# EasyEDA Pro project miniMQ.epro, board ArtNet-Pico
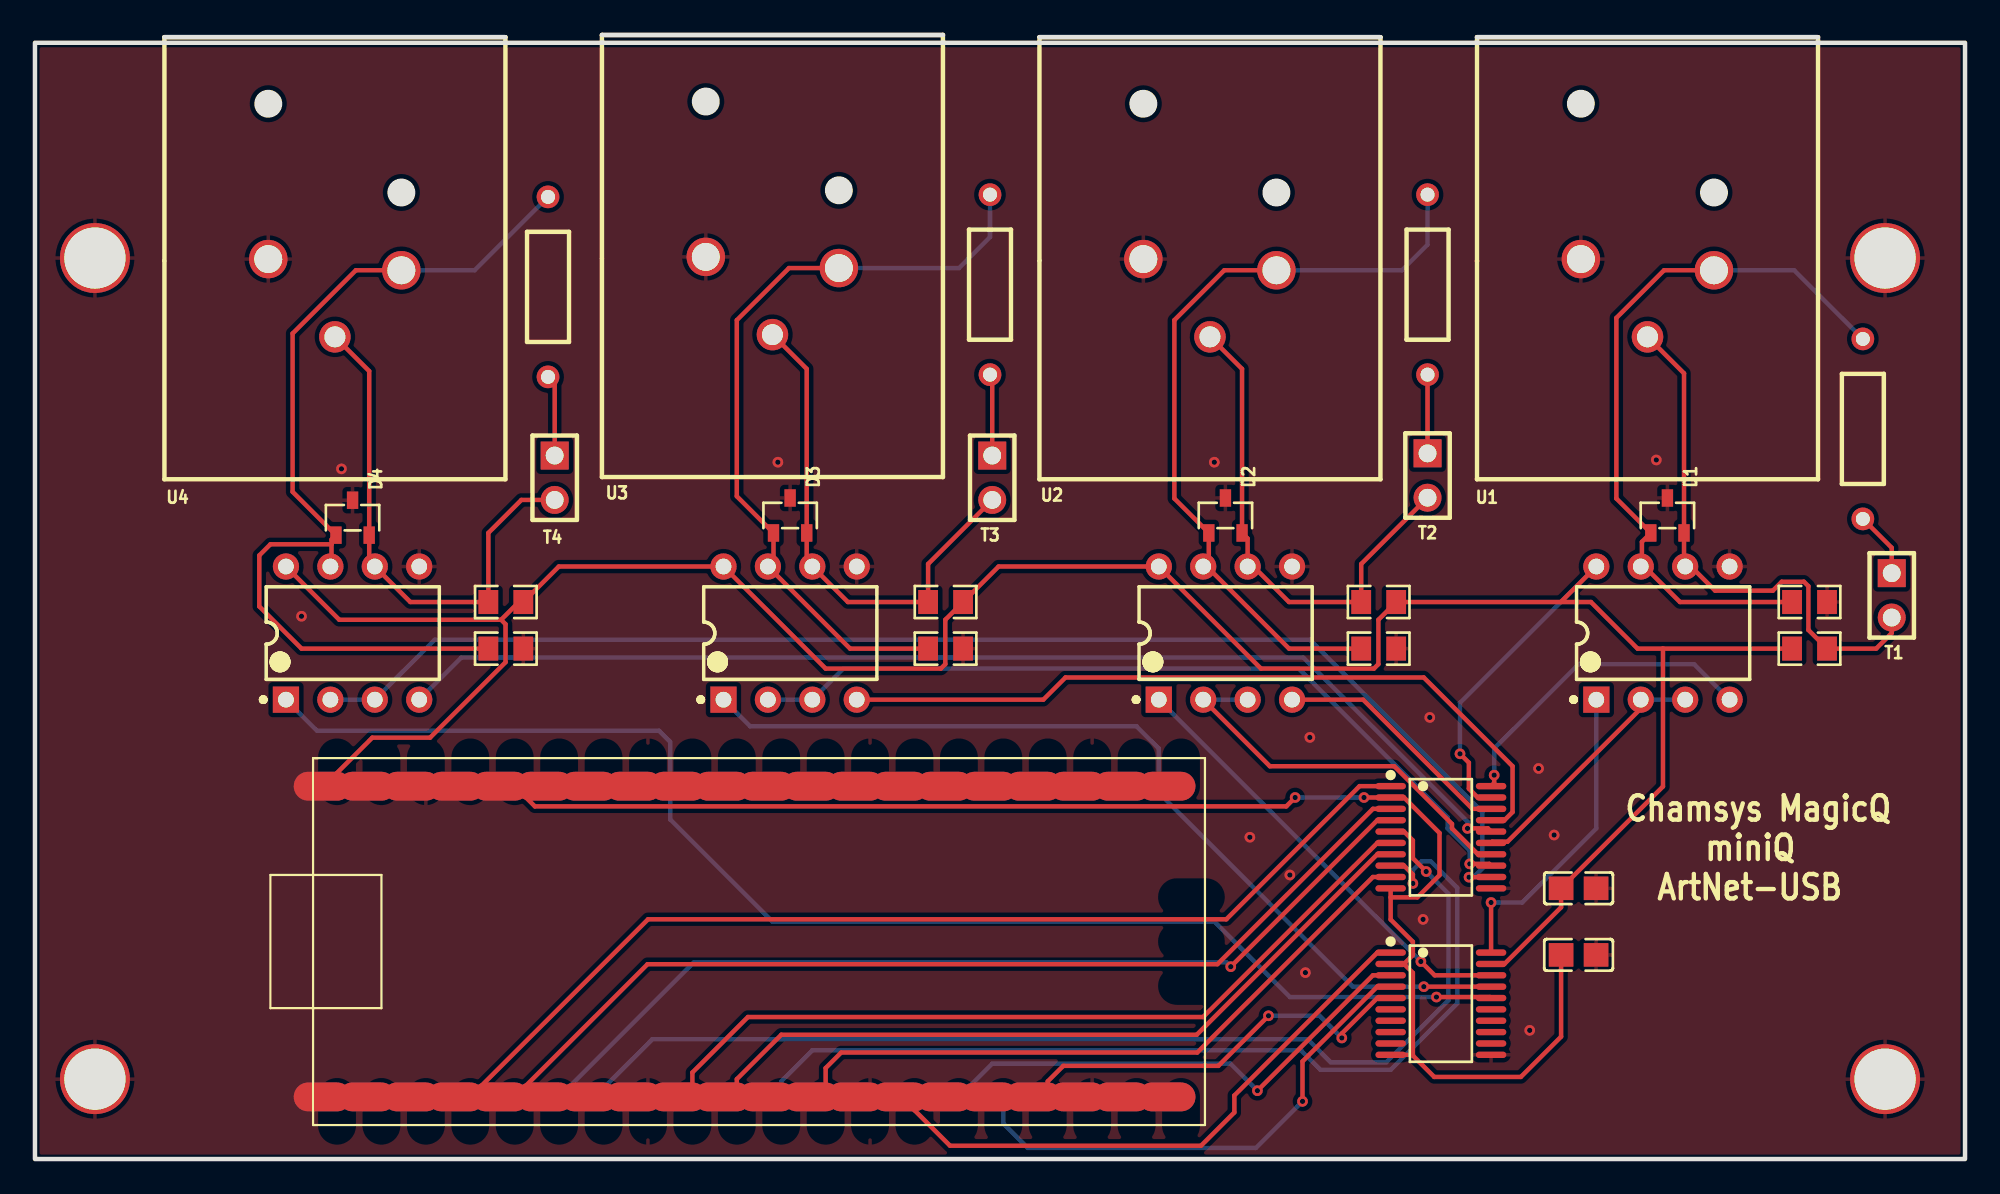
[diagram p13: board, top side]
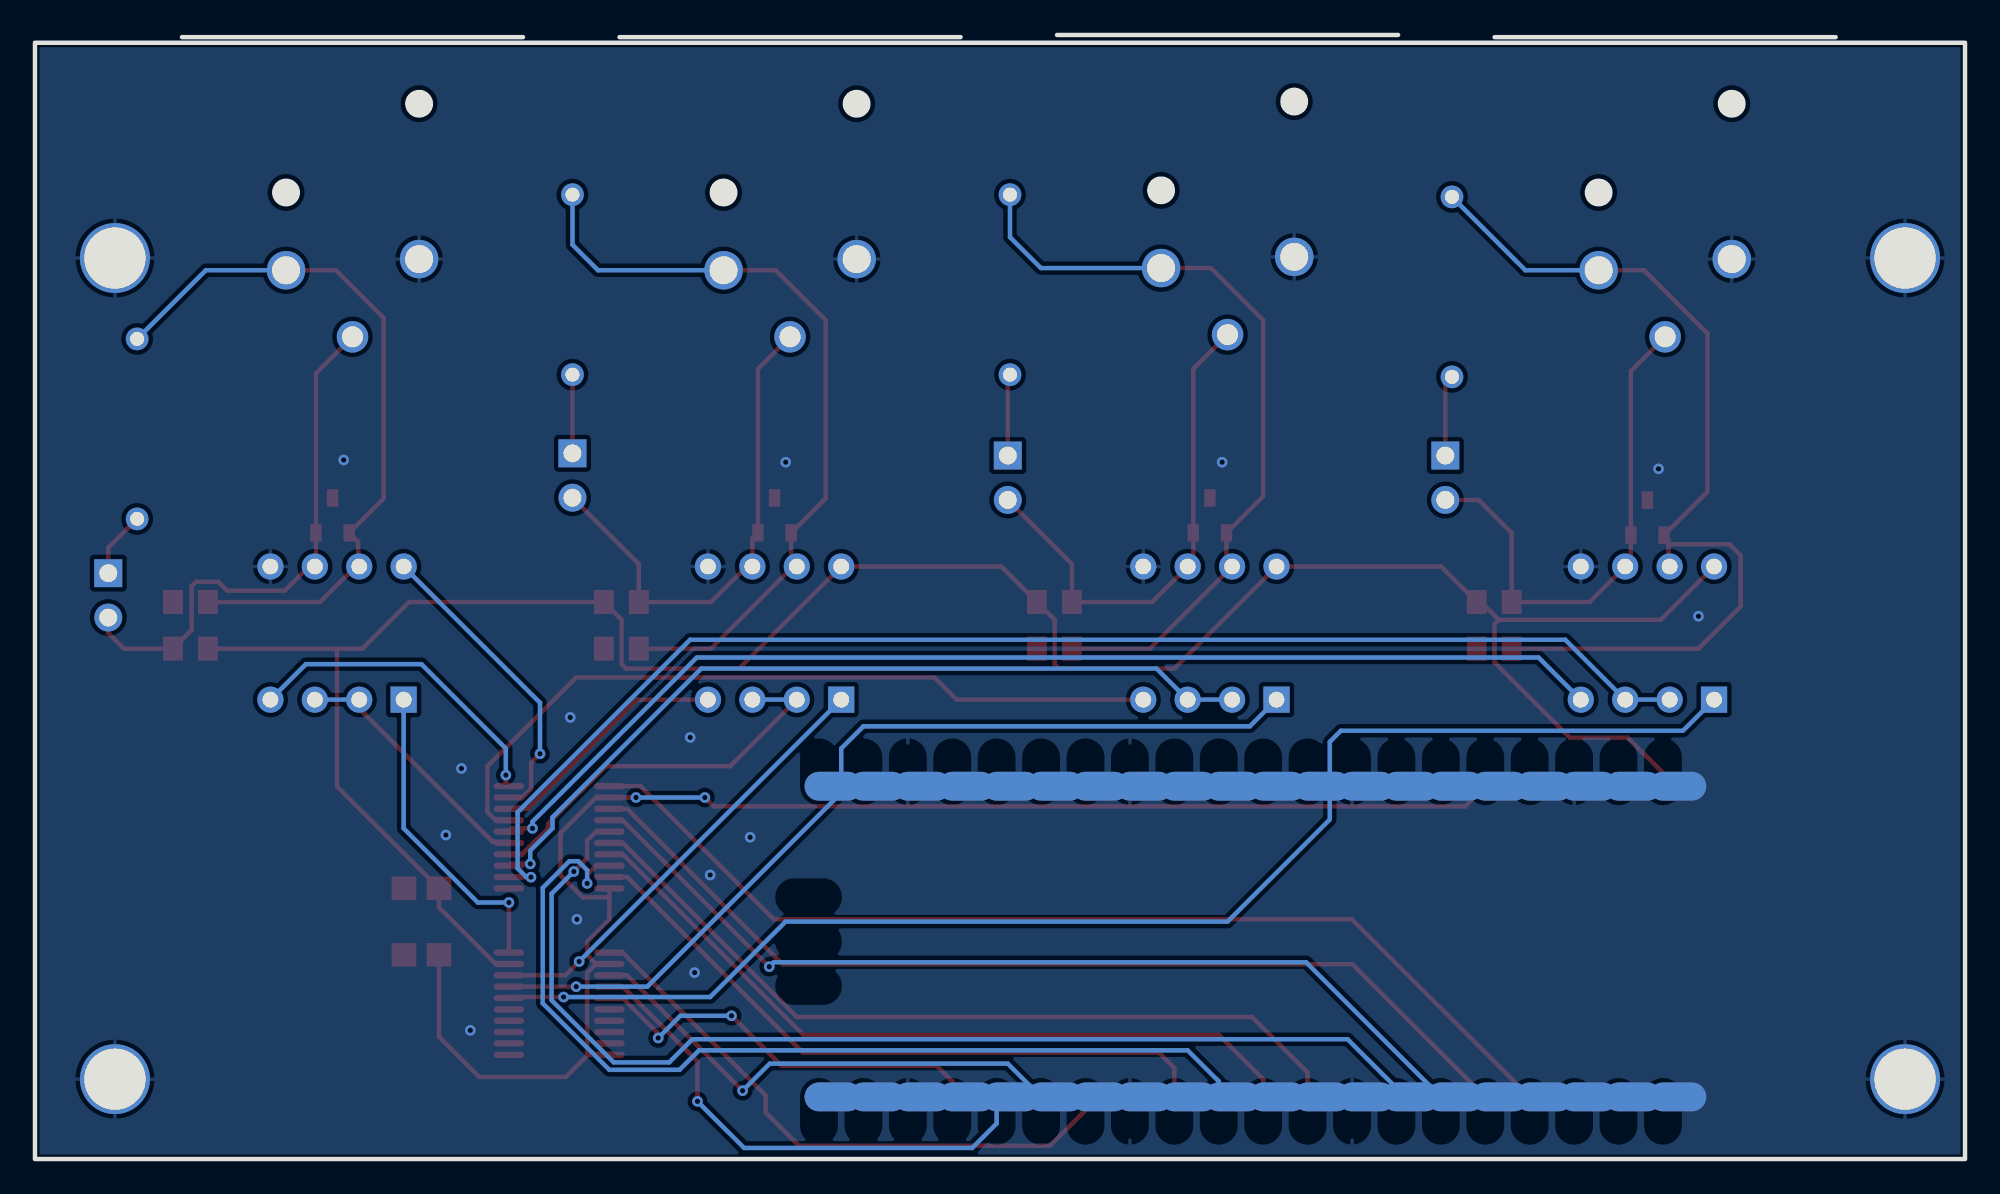
[diagram p14: board, bottom side, seen from below]

Outline 110.36 x 64.33 mm; copper layers: Top Layer, Bottom Layer. Coordinates in mm from the lower left corner of the outline.
Outline path: rectangle 0,63.88 110.36,0
Stack: Top Layer 0.035mm / Dielectric1 1.51mm FR4 er 4.5 / Bottom Layer 0.035mm

## Design rules (mm)
template: JLCPCB Capability(Two Layers Board)
spacing copperThickness1oz (default): track to track 0.102, other pairs 0.152 to 0.3
spacing copperThickness2oz: track to track 0.203, other pairs 0.152 to 0.3
track width copperThickness1oz (default): min 0.127, default 0.254, max 2.54
track width copperThickness2oz: min 0.203, default 0.254, max 2.54
differential pair differentialPair (default): width min 0.127, default 0.254, max 2.54; gap min 0.152, default 0.152
via viaSize (default): diameter min 0.5, default 0.61, max 10; hole min 0.3, default 0.305, max 6.3

## Placement (name value [footprint] x y rotation side)
C1  100nF  [C0805]  88.27 15.49 0 top
C2  100nF  [C0805]  88.27 11.68 180 top
D1  SM712-02HTG  [SOT-23-3_L2.9-W1.3-P1.90-LS2.4-BR]  93.34 36.83 270 top
D2  SM712-02HTG  [SOT-23-3_L2.9-W1.3-P1.90-LS2.4-BR]  68.07 36.83 270 top
D3  SM712-02HTG  [SOT-23-3_L2.9-W1.3-P1.90-LS2.4-BR]  43.18 36.83 270 top
D4  SM712-02HTG  [SOT-23-3_L2.9-W1.3-P1.90-LS2.4-BR]  18.16 36.7 270 top
NOREF  -  [Pad_e91]  105.79 51.56 0 top
NOREF#2  -  [Pad_e92]  105.79 4.57 0 top
NOREF#3  -  [Pad_e93]  3.43 4.57 0 top
NOREF#4  -  [Pad_e90]  3.43 51.56 0 top
R31  560Ω  [R0805]  101.47 31.88 0 top
R32  560Ω  [R0805]  101.47 29.21 180 top
R33  560Ω  [R0805]  76.83 29.21 0 top
R34  560Ω  [R0805]  76.83 31.88 0 top
R35  560Ω  [R0805]  52.07 29.21 0 top
R36  560Ω  [R0805]  52.07 31.88 0 top
R37  560Ω  [R0805]  26.92 29.21 0 top
R38  560Ω  [R0805]  26.92 31.88 0 top
T1  2.54x2.5 1x2P PA6.0 PC3.0 L11.6  [HDR-TH_2P-P2.54-V-M-R2-C1-S2.54_3]  106.17 32.26 180 top
T2  2.54x2.5 1x2P PA6.0 PC3.0 L11.6  [HDR-TH_2P-P2.54-V-M-R2-C1-S2.54_3]  79.63 39.12 180 top
T3  2.54x2.5 1x2P PA6.0 PC3.0 L11.6  [HDR-TH_2P-P2.54-V-M-R2-C1-S2.54_3]  54.74 38.99 180 top
T4  2.54x2.5 1x2P PA6.0 PC3.0 L11.6  [HDR-TH_2P-P2.54-V-M-R2-C1-S2.54_3]  29.72 38.99 180 top
U1  CT3-12AFAP-EP  [CONN-TH_CT3-12AFAP-EP]  92.2 49.28 0 top
U2  CT3-12AFAP-EP  [CONN-TH_CT3-12AFAP-EP]  67.18 49.28 0 top
U3  CT3-12AFAP-EP  [CONN-TH_CT3-12AFAP-EP]  42.16 49.4 0 top
U4  CT3-12AFAP-EP  [CONN-TH_CT3-12AFAP-EP]  17.14 49.28 0 top
U11  MAX3485EPA  [DIP-8_L9.8-W6.6-P2.54-LS7.6-BL]  93.09 30.1 0 top
U12  MAX3485EPA  [DIP-8_L9.8-W6.6-P2.54-LS7.6-BL]  68.07 30.1 0 top
U13  MAX3485EPA  [DIP-8_L9.8-W6.6-P2.54-LS7.6-BL]  43.18 30.1 0 top
U14  MAX3485EPA  [DIP-8_L9.8-W6.6-P2.54-LS7.6-BL]  18.16 30.1 0 top
U99  AUDIO_PICO1  [RASPBERRYPIPICO]  17.27 3.56 0 top
U100  120Ω  [RES-TH_BD2.4-L6.3-P10.30-D0.6]  104.52 41.78 270 top
U101  120Ω  [RES-TH_BD2.4-L6.3-P10.30-D0.6]  79.63 50.04 270 top
U102  120Ω  [RES-TH_BD2.4-L6.3-P10.30-D0.6]  54.61 50.04 270 top
U103  120Ω  [RES-TH_BD2.4-L6.3-P10.30-D0.6]  29.34 49.91 270 top
U104  TXS0108EPWR  [TSSOP-20_L6.5-W4.4-P0.65-LS6.4-BL]  80.39 8.89 270 top
U105  TXS0108EPWR  [TSSOP-20_L6.5-W4.4-P0.65-LS6.4-BL]  80.39 18.42 270 top

## Footprints (pads in the part's own frame, mm; a bottom-side part is the same pattern mirrored in y, then rotated)
C0805
  rect 1.41x1.35 smd: 1(-1,0) 2(1,0)
CONN-TH_CT3-12AFAP-EP
  round 2.2 hole 1.6: 1(-3.805,2.225) 2(3.805,1.585)
  round 1.8 hole 1.2: 3(0.005,-2.225)
DIP-8_L9.8-W6.6-P2.54-LS7.6-BL
  rect 1.5x1.5 hole 0.9: 1(-3.81,-3.81)
  round 1.5 hole 0.9: 2(-1.27,-3.81) 3(1.27,-3.81) 4(3.81,-3.81) 5(3.81,3.81) 6(1.27,3.81) 7(-1.27,3.81) 8(-3.81,3.81)
HDR-TH_2P-P2.54-V-M-R2-C1-S2.54_3
  rect 1.6x1.6 hole 1.02: 1(0,-1.27)
  round 1.6 hole 1.02: 2(0,1.27)
Pad_e90
  round 4 hole 3.5: 1(0,0)
Pad_e91
  round 4 hole 3.5: 1(0,0)
Pad_e92
  round 4 hole 3.5: 1(0,0)
Pad_e93
  round 4 hole 3.5: 1(0,0)
R0805
  rect 1.133x1.377 smd: 1(-1,0) 2(1,0)
RASPBERRYPIPICO
  custom 3.297x1.65 hole 1.1: 3V3(OUT)(10.16,17.78) 3V3_EN(7.62,17.78) ADC_VREF(12.7,17.78) GND(5.08,0) GND1(17.78,0) GND2(30.48,0) GND3(43.18,0) GND4(5.08,17.78) GND5(17.78,17.78) GND6(30.48,17.78) GND7(43.18,17.78) GP0(0,0) GP1(2.54,0) GP2(7.62,0) GP3(10.16,0) GP4(12.7,0) GP5(15.24,0) GP6(20.32,0) GP7(22.86,0) GP8(25.4,0) GP9(27.94,0) GP10(33.02,0) GP11(35.56,0) GP12(38.1,0) GP13(40.64,0) GP14(45.72,0) GP15(48.26,0) GP16(48.26,17.78) GP17(45.72,17.78) GP18(40.64,17.78) GP19(38.1,17.78) GP20(35.56,17.78) GP21(33.02,17.78) GP22(27.94,17.78) GP26(22.86,17.78) GP27(20.32,17.78) GP28(15.24,17.78) RUN(25.4,17.78) VBUS(0,17.78) VSYS(2.54,17.78)
RES-TH_BD2.4-L6.3-P10.30-D0.6
  round 1.3 hole 0.8: 1(-5.15,0) 2(5.15,0)
SOT-23-3_L2.9-W1.3-P1.90-LS2.4-BR
  rect 1x0.65 smd: 1(1,-0.95) 2(1,0.95) 3(-1,0)
TSSOP-20_L6.5-W4.4-P0.65-LS6.4-BL
  oval 0.364x1.742 smd: 1(-2.925,-2.871) 2(-2.275,-2.871) 3(-1.625,-2.871) 4(-0.975,-2.871) 5(-0.325,-2.871) 6(0.325,-2.871) 7(0.975,-2.871) 8(1.625,-2.871) 9(2.275,-2.871) 10(2.925,-2.871) 11(2.925,2.871) 12(2.275,2.871) 13(1.625,2.871) 14(0.975,2.871) 15(0.325,2.871) 16(-0.325,2.871) 17(-0.975,2.871) 18(-1.625,2.871) 19(-2.275,2.871) 20(-2.925,2.871)

## Nets
As in the schematic, except:
GND: C1.2 C2.1 D1.3 D2.3 D3.3 D4.3 NOREF.1 NOREF#2.1 NOREF#3.1 NOREF#4.1 R31.2 R33.2 R35.2 R37.2 U1.1 U2.1 U3.1 U4.1 U11.5 U12.5 U13.5 U14.5 U99.GND1 U99.GND2 U99.GND3 U99.GND4 U99.GND5 U99.GND6 U99.GND7 U104.11 U105.11

Pads without a net: U99 3V3_EN ADC_VREF GND GP0 GP1 GP14 GP15 GP16 GP17 GP18 GP19 GP20 GP21 GP22 GP26 GP27 GP28 RUN VSYS; U104 6 7 8 9 12 13 14 15

## Via types
v1: diameter 0.61, hole 0.305, Top Layer to Bottom Layer, 32 vias

## Routing (per net, layer and track width the routed paths; a pad name or vN(x,y) marks a point on that pad's centre or on a via; arc(x,y) is an arc through that point)
3.3V: length 87.3
  Top Layer w0.254: 77.52,14.98 U105.10 ; 77.52,14.98 79.04,14.98 80.31,16.25 80.31,18.66 78.28,20.69 U105.2 v1(76,20.69) ; 77.52,14.98 77.52,13.71 78.79,12.44 78.79,11.67 78.28,11.17 ; 78.28,11.17 78.79,10.66 78.79,5.97 ; 78.28,11.17 U104.2 ; v1(72.06,20.69) 71.55,20.18 28.59,20.18 27.43,21.34 ; 78.79,5.97 78.79,5.92 80.01,4.7 84.96,4.7 87.27,7 C2.2 ; 78.79,5.97 U104.10
  Bottom Layer w0.254: v1(76,20.69) v1(72.06,20.69)
5V: length 160.2
  Top Layer w0.254: 26.65,30.86 27.67,31.88 R38.2 29.96,33.91 U13.8 45.21,28.07 51.8,28.07 52.05,28.32 52.05,30.86 R36.2 55.1,33.91 U12.8 70.1,28.07 76.56,28.07 76.82,28.32 76.82,30.86 R34.2 87.25,31.88 ; 26.65,30.86 17.4,30.86 U14.8 ; 26.65,30.86 26.91,30.61 26.91,28.43 22.59,24.11 19.29,24.11 17.27,22.1 U99.VBUS ; 87.25,31.88 U11.8 ; 87.25,31.88 88.97,31.88 91.64,29.21 93.09,29.21 ; 83.26,11.17 84.02,11.17 87.27,14.41 C1.1 93.09,21.32 93.09,29.21 ; 93.09,29.21 R32.2 ; v1(81.48,23.19) 81.99,22.68 81.99,21.2 82.5,20.69 83.26,20.69
  Bottom Layer w0.254: U11.8 81.48,26.11 v1(81.48,23.19)
GND:
  vias: v1(15.24,31.06) v1(17.53,39.5) v1(42.48,39.88) v1(67.44,39.88) v1(69.47,18.42) v1(71.76,16.26) v1(72.64,10.67) v1(72.9,24.13) v1(79.37,13.72) v1(79.76,25.27) v1(85.47,7.37) v1(85.98,22.35) v1(86.87,18.54) v1(92.71,40.01)
U1RDM: length 46.8
  Top Layer w0.254: U105.6 76.76,18.09 66.8,8.13 40.77,8.13 37.59,4.95 U99.GP6
U1RDM5: length 14.8
  Top Layer w0.254: U11.2 91.82,25.78 84.2,18.16 83.33,18.16 83.26,18.09
  Bottom Layer w0.254: U11.2 U11.3
U1RX: length 34
  Top Layer w0.254: U99.GP10 50.29,2.79 52.32,0.76 66.67,0.76 68.58,2.67 68.58,3.64 76.76,11.82 U104.1
U1RX5: length 18
  Top Layer w0.254: v1(83.26,14.68) 83.26,11.82
  Bottom Layer w0.254: v1(83.26,14.68) 85.04,14.68 89.28,18.92 U11.1
U1TX: length 60
  Top Layer w0.254: U105.1 75.74,21.34 68.12,13.72 35.06,13.72 U99.GP2
U1TX5: length 18.5
  Top Layer w0.254: 83.26,21.34 83.44,21.52 v1(83.44,21.97)
  Bottom Layer w0.254: U11.4 94.87,28.32 88.27,28.32 83.44,23.5 v1(83.44,21.97)
U2RDM: length 43.7
  Top Layer w0.254: U105.7 76.76,17.44 66.43,7.11 42.67,7.11 40.13,4.57 U99.GP7
U2RDM5: length 22.8
  Top Layer w0.254: 83.26,17.44 82.51,17.44 81.03,18.92 81.03,19.18 77.72,22.48 70.61,22.48 U12.2
  Bottom Layer w0.254: U12.2 U12.3
U2RX: length 28.9
  Top Layer w0.254: v1(69.9,3.91) 76.5,10.52 U104.3
  Bottom Layer w0.254: U99.GP11 54.74,5.46 68.35,5.46 v1(69.9,3.91)
U2RX5: length 25.5
  Top Layer w0.254: 83.26,10.52 80.04,10.52 v1(79.25,11.3)
  Bottom Layer w0.254: U12.1 v1(79.25,11.3)
U2TX: length 56.9
  Top Layer w0.254: 27.43,3.56 35.03,11.15 67.61,11.15 76.5,20.04 U105.3
U2TX5: length 14
  Top Layer w0.254: 83.26,20.04 82.2,20.04 75.95,26.29 U12.4
U3RDM: length 55.1
  Top Layer w0.254: U105.8 78.28,16.79 78.79,16.28 v1(78.79,15.77)
  Bottom Layer w0.254: U99.GP8 42.67,4.45 44.45,6.22 72.39,6.22 73.51,5.11 77.52,5.11 81.33,8.92 81.33,15.52 79.81,17.04 79.3,17.04 78.79,16.54 v1(78.79,15.77)
U3RDM5: length 47.6
  Top Layer w0.254: v1(82.04,16.89) 83.16,16.89 83.26,16.79
  Bottom Layer w0.254: v1(82.04,16.89) 82.04,17.65 80.77,18.92 80.77,19.56 72.26,28.07 46.23,28.07 U13.3 U13.2
U3RX: length 29.4
  Top Layer w0.254: v1(72.48,3.3) 72.48,5.59 76.76,9.87 U104.4
  Bottom Layer w0.254: v1(72.48,3.3) 69.81,0.64 56.77,0.64 55.37,2.03 U99.GP12
U3RX5: length 52.2
  Top Layer w0.254: v1(79.42,9.87) 83.26,9.87
  Bottom Layer w0.254: v1(79.42,9.87) 75.35,9.87 64.26,20.96 64.26,23.5 62.99,24.77 40.89,24.77 U13.1
U3TX: length 54.3
  Top Layer w0.254: U105.4 76.76,19.39 v1(68.38,11.01)
  Bottom Layer w0.254: U99.GP4 37.68,11.26 68.12,11.26 v1(68.38,11.01)
U3TX5: length 44.2
  Top Layer w0.254: U13.4 57.66,26.29 58.93,27.56 79.41,27.56 84.49,22.48 84.49,19.86 84.02,19.39 83.26,19.39
U4RDM: length 38.5
  Top Layer w0.254: U105.9 76.5,16.14 66.46,6.1 46.1,6.1 45.21,5.21 U99.GP9
U4RDM5: length 76.8
  Top Layer w0.254: v1(82,16.13) 83.25,16.13 83.26,16.14
  Bottom Layer w0.254: v1(82,16.13) 82.26,16.13 82.77,16.64 82.77,19.85 72.9,29.72 22.86,29.72 U14.3 U14.2
U4RX: length 23.7
  Top Layer w0.254: U104.5 76.76,9.22 74.73,7.18 v1(74.73,6.93) ; v1(70.53,8.2) 67.67,5.33 58.8,5.33 57.91,4.45 U99.GP13
  Bottom Layer w0.254: v1(70.53,8.2) 73.46,8.2 v1(74.73,6.93)
U4RX5: length 78.6
  Top Layer w0.254: 83.26,9.22 83.21,9.27 v1(80.14,9.27)
  Bottom Layer w0.254: U14.1 16.13,24.51 35.69,24.51 36.32,23.88 36.32,19.43 42.16,13.59 67.44,13.59 71.76,9.27 v1(80.14,9.27)
U4TX: length 63.5
  Top Layer w0.254: U105.5 78.28,18.74 78.79,18.23 78.79,17.22 v1(79.55,16.45)
  Bottom Layer w0.254: v1(79.55,16.45) 80.82,15.18 80.82,9.09 77.27,5.53 74.1,5.53 72.77,6.86 35.31,6.86 32.51,4.06 32.51,3.56
U4TX5: length 66.6
  Top Layer w0.254: v1(81.92,18.92) 83.08,18.92 83.26,18.74
  Bottom Layer w0.254: U14.4 24.38,28.7 72.52,28.7 81.92,19.3 v1(81.92,18.92)
$1N562: length 45.1
  Top Layer w0.254: 66.87,34.05 71.71,29.21 R33.1 ; 66.87,34.05 66.87,34.31 67.12,34.56 D2.1 65.15,37.8 65.15,48.01 68.01,50.86 70.99,50.86 ; 66.87,34.05 66.87,33.98 U12.7
  Bottom Layer w0.254: 70.99,50.86 78.17,50.86 79.63,52.32 U101.1
$1N566: length 29
  Top Layer w0.254: T2.2 75.83,34.05 R34.1 71.7,31.88 69.53,34.05 U12.6 69.34,35.51 D2.2 69.02,45.22 U2.3
$1N570: length 41.6
  Top Layer w0.254: R31.1 94.06,31.88 91.89,34.05 ; 91.89,34.05 91.89,35.32 D1.1 90.42,37.8 90.42,48.13 93.15,50.86 96.01,50.86 ; 91.89,34.05 91.89,33.98 U11.7
  Bottom Layer w0.254: 96.01,50.86 100.59,50.86 U100.1
$1N572: length 31
  Top Layer w0.254: 94.55,34.05 U11.6 ; 94.55,34.05 96.07,32.53 99.37,32.53 99.88,33.04 101.15,33.04 101.41,32.78 101.41,30.28 R32.1 105.28,29.21 106.17,30.1 T1.2 ; 94.55,34.05 94.3,34.31 D1.2 94.3,44.96 U1.3
$1N1506: length 53.7
  Top Layer w0.254: 16.96,35.18 13.46,35.18 12.83,34.54 12.83,31.62 15.24,29.21 R37.1 ; 16.96,35.18 16.96,33.98 U14.7 ; 16.96,35.18 16.96,35.45 D4.1 14.73,38.18 14.73,47.24 18.35,50.86 20.95,50.86
  Bottom Layer w0.254: U103.1 25.14,50.86 20.95,50.86
$1N1508: length 30
  Top Layer w0.254: U4.3 19.11,45.09 D4.2 19.11,34.23 21.46,31.88 R38.1 25.92,35.83 27.81,37.72 29.72,37.72
$1N3125: length 29
  Top Layer w0.254: 54.74,37.72 51.07,34.05 R36.1 46.48,31.88 44.13,34.23 D3.2 44.13,45.22 U3.3
$1N3129: length 45.1
  Top Layer w0.254: R35.1 46.61,29.21 U13.7 42.23,34.23 D3.1 40.13,37.93 40.13,48.01 43.11,50.99 U3.2
  Bottom Layer w0.254: U3.2 52.84,50.99 54.61,52.76 U102.1
$1N9213: length 3.8
  Top Layer w0.254: T1.1 106.17,34.98 U100.2
$1N9270: length 4.5
  Top Layer w0.254: T2.1 U101.2
$1N9328: length 4.7
  Top Layer w0.254: U102.2 54.74,44.76 T3.1
$1N9385: length 4.7
  Top Layer w0.254: T4.1 29.72,44.38 U103.2

## Copper pours and planes (outline as drawn; the poured copper is in the pictures)
GND on Top Layer: -3.3,66.04 113.41,66.04 113.41,-3.17 -3.3,-3.17
GND on Bottom Layer: -6.98,69.47 112.9,69.47 112.9,-5.08 -6.98,-5.08

## Text on the board
Top Silkscreen Layer: Chamsys MagicQ / miniQ / ArtNet-USB
